# EAGLE design test (EAGLE 7.2.0)
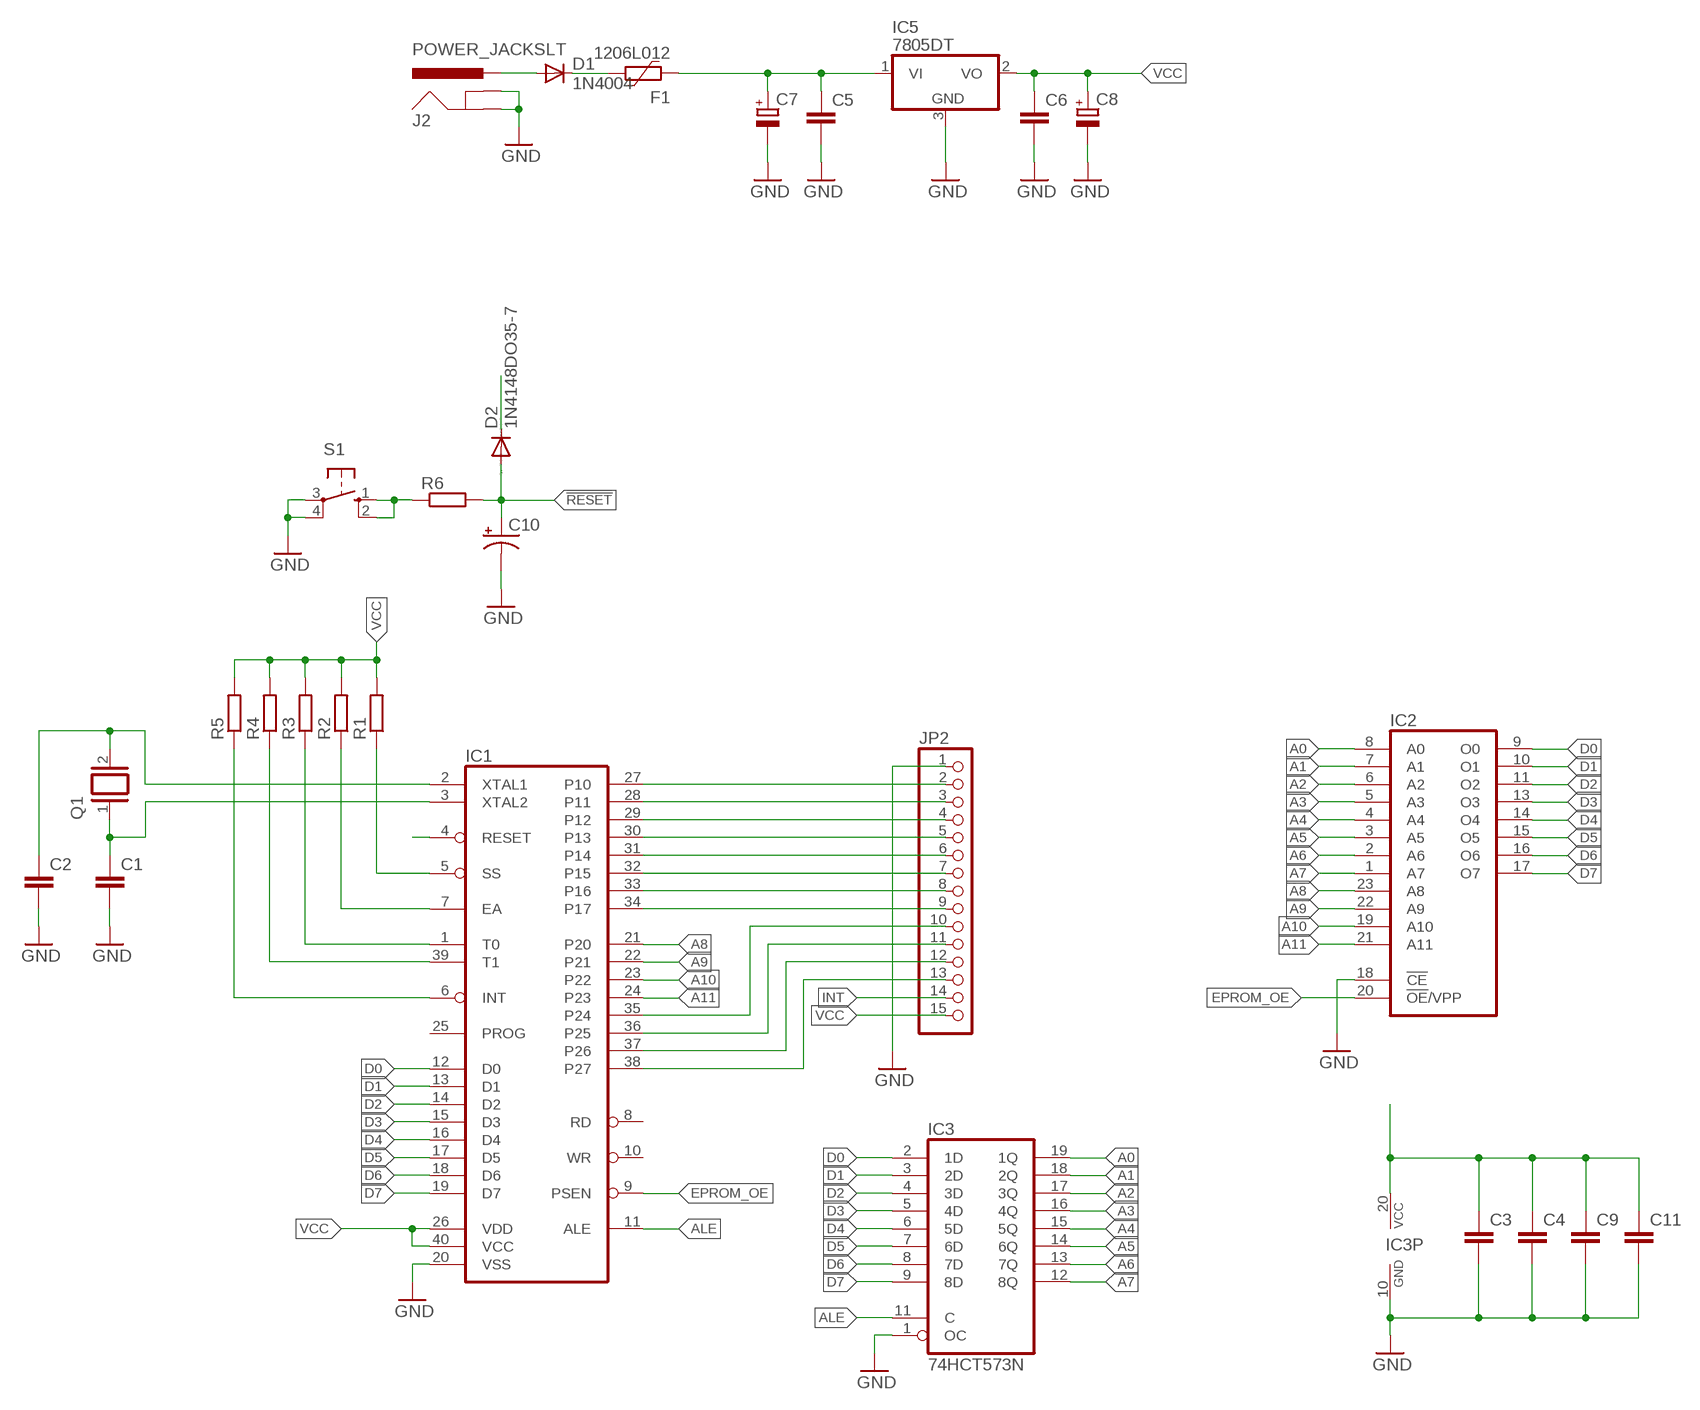
[diagram p0: schematic, sheet 1]

## Parts
C1  C-EUC0603  [C0603]
C2  C-EUC0603  [C0603]
C3  C-EUC0603  [C0603]
C4  C-EUC0603  [C0603]
C5  C-EUC0603  [C0603]
C6  C-EUC0603  [C0603]
C7  CPOL-EUSMCB  [SMC_B]
C8  CPOL-EUSMCB  [SMC_B]
C9  C-EUC0603  [C0603]
C10  CPOL-USE2,5-6E  [E2,5-6E]
C11  C-EUC0603  [C0603]
D1  1N4004  [DO41-10]
D2  1N4148DO35-7  [DO35-7]
F1  1206L012  [1206L]
IC1  8048  [DIL40]
IC2  2732  [DIL24]
IC3  74HCT573N  [DIL20]
IC5  7805DT  [TO252]
J2  POWER_JACKSLT  [POWER_JACK_SLOT]
JP2  PINHD-1X15  [1X15]
Q1  XTAL/S  [QS]
R1  R-EU_R1206  [R1206]
R2  R-EU_R1206  [R1206]
R3  R-EU_R1206  [R1206]
R4  R-EU_R0603  [R0603]
R5  R-EU_R1206  [R1206]
R6  R-EU_R0603  [R0603]
S1  10-XX  [B3F-10XX]

## Nets
9V: C5.1 C7.+ F1.2 IC5.1(VI)
!RESET: C10.+ D2.A IC1.4(RESET) R6.2
A0: IC2.8(A0) IC3.19(1Q)
A1: IC2.7(A1) IC3.18(2Q)
A2: IC2.6(A2) IC3.17(3Q)
A3: IC2.5(A3) IC3.16(4Q)
A4: IC2.4(A4) IC3.15(5Q)
A5: IC2.3(A5) IC3.14(6Q)
A6: IC2.2(A6) IC3.13(7Q)
A7: IC2.1(A7) IC3.12(8Q)
A8: IC1.21(P20) IC2.23(A8)
A9: IC1.22(P21) IC2.22(A9)
A10: IC1.23(P22) IC2.19(A10)
A11: IC1.24(P23) IC2.21(A11)
ALE: IC1.11(ALE) IC3.11(C)
D0: IC1.12(D0) IC2.9(O0) IC3.2(1D)
D1: IC1.13(D1) IC2.10(O1) IC3.3(2D)
D2: IC1.14(D2) IC2.11(O2) IC3.4(3D)
D3: IC1.15(D3) IC2.13(O3) IC3.5(4D)
D4: IC1.16(D4) IC2.14(O4) IC3.6(5D)
D5: IC1.17(D5) IC2.15(O5) IC3.7(6D)
D6: IC1.18(D6) IC2.16(O6) IC3.8(7D)
D7: IC1.19(D7) IC2.17(O7) IC3.9(8D)
EPROM_OE: IC1.9(PSEN) IC2.20(!OE!/VPP)
GND: C1.2 C2.2 C3.2 C4.2 C5.2 C6.2 C7.- C8.- C9.2 C10.- C11.2 IC1.20(VSS) IC2.18(!CE) IC3.1(OC) IC3.10(GND) IC5.3(GND) J2.GND@1(GNDBREAK) J2.GND@2(GND) JP2.1 S1.3(P) S1.4(P1)
INT: IC1.6(INT) JP2.14 R5.1
N$1: C1.1 IC1.3(XTAL2) Q1.1
N$2: C2.1 IC1.2(XTAL1) Q1.2
N$3: IC1.5(SS) R1.1
N$4: IC1.7(EA) R2.1
N$5: IC1.1(T0) R3.1
N$6: IC1.39(T1) R4.1
N$8: R6.1 S1.1(S) S1.2(S1)
N$9: IC1.27(P10) JP2.2
N$10: IC1.28(P11) JP2.3
N$11: IC1.29(P12) JP2.4
N$12: IC1.30(P13) JP2.5
N$13: IC1.31(P14) JP2.6
N$14: IC1.32(P15) JP2.7
N$15: IC1.33(P16) JP2.8
N$16: IC1.34(P17) JP2.9
N$17: IC1.35(P24) JP2.10
N$18: D1.A J2.PWR
N$19: IC1.36(P25) JP2.11
N$20: D1.C F1.1
N$21: IC1.37(P26) JP2.12
N$22: IC1.38(P27) JP2.13
VCC: C3.1 C4.1 C6.1 C8.+ C9.1 C11.1 D2.C IC1.26(VDD) IC1.40(VCC) IC3.20(VCC) IC5.2(VO) JP2.15 R1.2 R2.2 R3.2 R4.2 R5.2
Unconnected: IC1.8(RD) IC1.10(WR) IC1.25(PROG)

## Power pins joined to a net without a drawn wire
GND: IC2.12(GND)
VCC: IC2.24(VCC)

## Library data of the parts
C1-C6 C9 C11 = rcl:C-EU: CAPACITOR, European symbol
C7 C8 = rcl:CPOL-EU: POLARIZED CAPACITOR, European symbol
C10 = rcl:CPOL-US: POLARIZED CAPACITOR, American symbol
D1 = adafruit:1N4004: DIODE General purpose 1N400x type rectifier (With bigger pads) http://www.ladyada.net/library/pcb/eaglelibrary.html
D2 = diode:1N4148: DIODE high speed (Philips)
F1 = polyfuse-smd_10:?: Polyfuse Resettable PTC Source: http://www.littelfuse.com/products/resettable-ptcs.aspx; MF: Littelfuse; MPN: 1206L012; OC_FARNELL: 1596988; OC_NEWARK: 05M2298
IC1 = micro-intel:8048: MICROCOMPUTER/PERIPHERAL DEVICE; OC_FARNELL: unknown; OC_NEWARK: unknown
IC2 = memory:2732: MEMORY
IC3 = 74xx-eu:74*573: 8-bit D latch BUS DRIVER
IC5 = linear:78*: Positive VOLTAGE REGULATOR Source: http://cache.national.com/ds/LM/LM78L05.pdf http://www.fairchildsemi.com/ds/LM/LM7805.pdf
J2 = SparkFun-Connectors:POWER_JACK: Power Jack This is the standard 5.5mm barrel jack for power. The PTH is the most common, proven, reliable, footprint. The Slot footprint only works if the mill layer is transmitted to the PCB fab house so be warned. Mating wall wart : TOL-00298 (and others); PROD_ID: PRT-00119
JP2 = pinhead:PINHD-1X15: PIN HEADER
Q1 = special:XTAL/S: CRYSTAL
R1-R6 = rcl:R-EU_: RESISTOR, European symbol
S1 = switch-omron:10-XX: OMRON SWITCH; MPN: B3F-1000; OC_FARNELL: 176432; OC_NEWARK: 36M3542

## Board
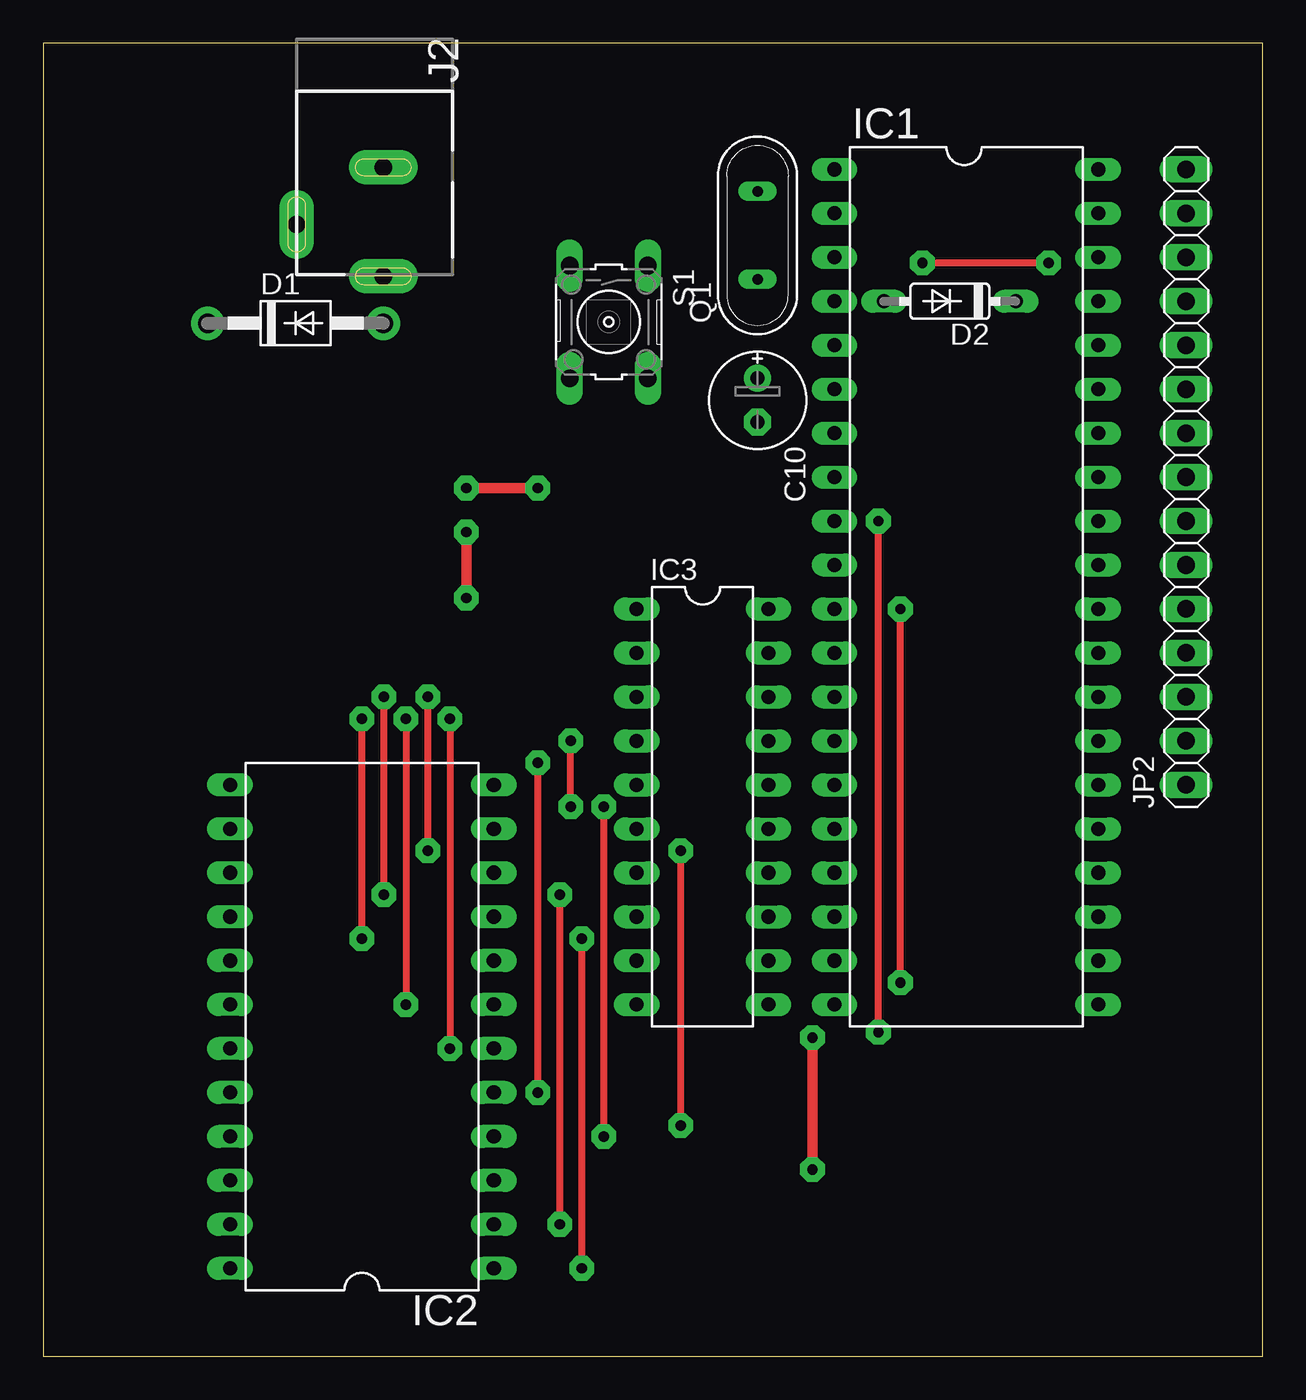
[diagram p1: board, top side]
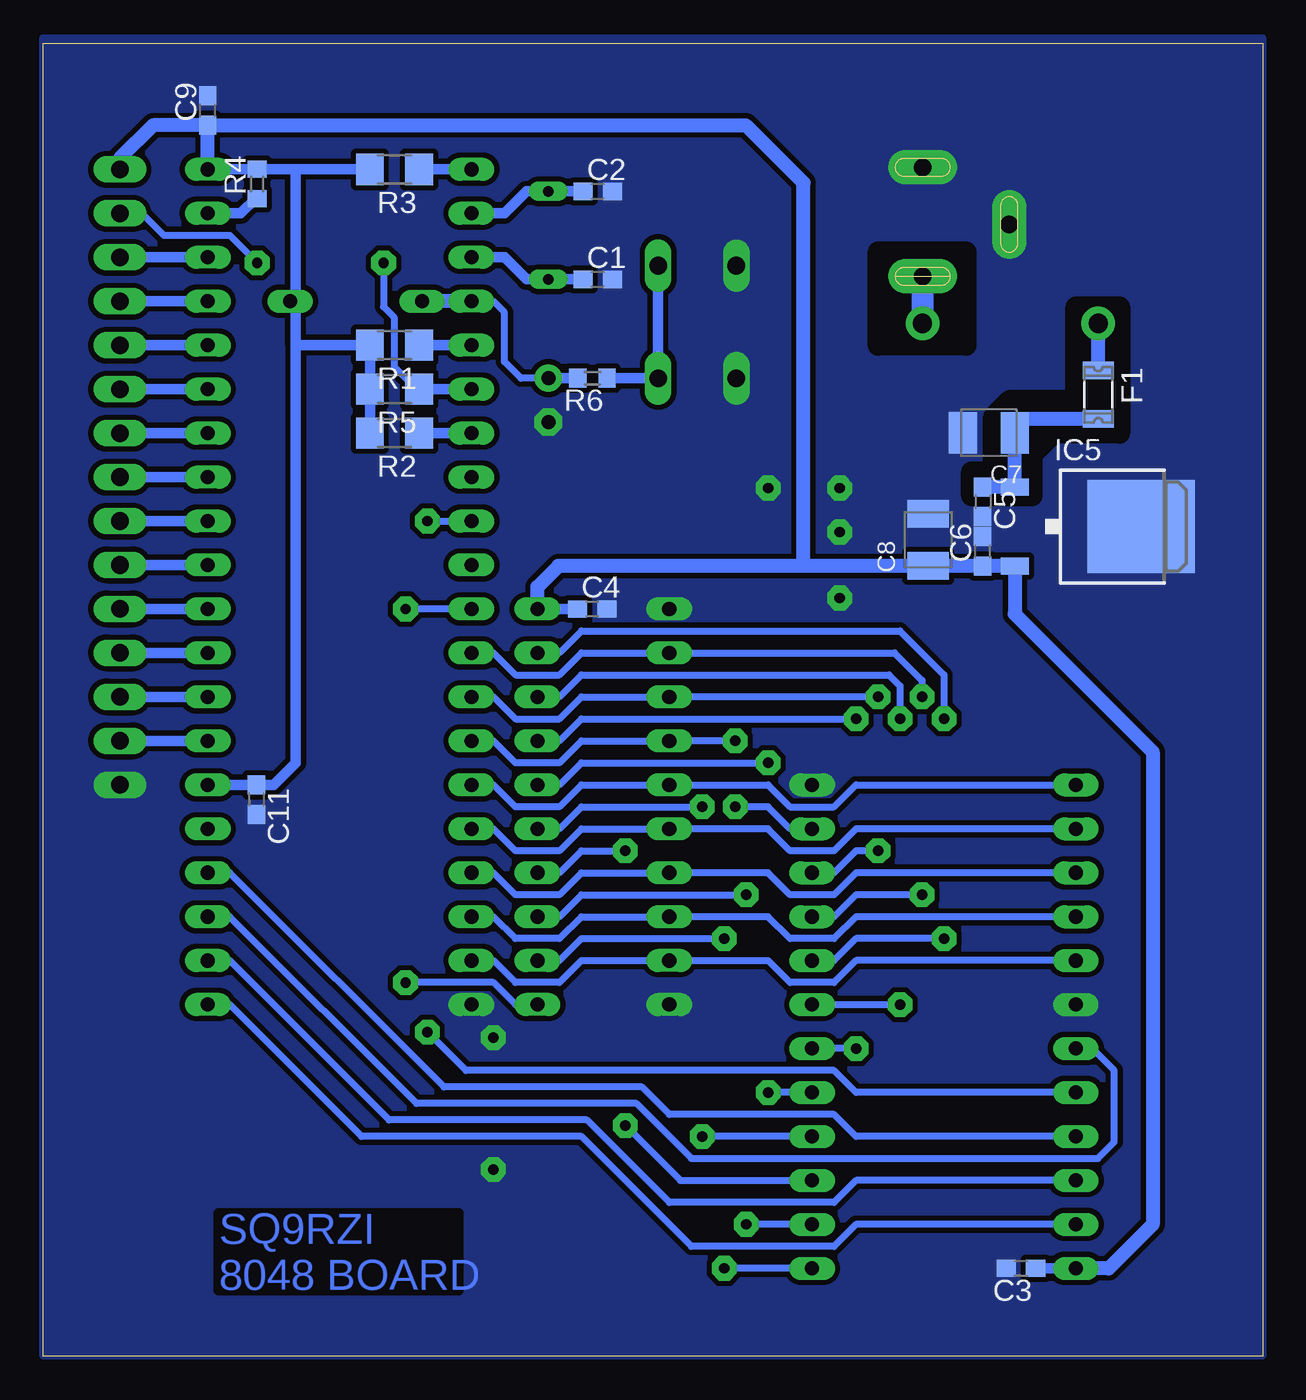
[diagram p2: board, bottom side, seen from below]

Size 70.47 x 75.87 mm. Coordinates in mm from the lower left corner, seen from the top.
Outline: 0,0 70.47,0 70.47,75.87 0,75.87 0,0
Copper layers (1*16): Top 0.035mm / dielectric 1.5mm / Bottom 0.035mm
Design rules "default *": minimum track width 10mil, minimum drill 24mil, track to track 8mil, track to pad 8mil, pad to pad 8mil, via to via 8mil, smd to smd 8mil, copper to edge 0mil, drill to drill 8mil, minimum pad ring 10mil, minimum via ring 8mil, stop-mask expansion 4mil, vias tented up to drill 0mil, thermal gap 10mil
bRestrict: area 17.1,58.4 to 22.2,63.8; area 8.3,49.7 to 16.8,60.6

### Footprints (pad centres in the part's own frame; a part is rotated, then mirrored left to right if it is on the bottom)
C0603 = smd 1.1 x 1: 1 -0.85,0; 2 0.85,0
SMC_B = smd 1.6 x 2.4: + -1.5,0; - 1.5,0
E2,5-6E = drill 0.813 pad 1.575: + -1.27,0 | drill 0.813 pad 1.575 octagon: - 1.27,0
DO41-10 = drill 1.118 pad 1.93: A 5.08,0; C -5.08,0
DO35-7 = drill 0.813 long: A 3.81,0; C -3.81,0
1206L = smd 1 x 1.8: 1 -1.4,0; 2 1.4,0
DIL40 = drill 0.813 long: 1 -24.13,-7.62; 2 -21.59,-7.62; 3 -19.05,-7.62; 4 -16.51,-7.62; 5 -13.97,-7.62; 6 -11.43,-7.62; 7 -8.89,-7.62; 8 -6.35,-7.62; 9 -3.81,-7.62; 10 -1.27,-7.62; 11 1.27,-7.62; 12 3.81,-7.62; 13 6.35,-7.62; 14 8.89,-7.62; 15 11.43,-7.62; 16 13.97,-7.62; 17 16.51,-7.62; 18 19.05,-7.62; 19 21.59,-7.62; 20 24.13,-7.62; 21 24.13,7.62; 22 21.59,7.62; 23 19.05,7.62; 24 16.51,7.62; 25 13.97,7.62; 26 11.43,7.62; 27 8.89,7.62; 28 6.35,7.62; 29 3.81,7.62; 30 1.27,7.62; 31 -1.27,7.62; 32 -3.81,7.62; 33 -6.35,7.62; 34 -8.89,7.62; 35 -11.43,7.62; 36 -13.97,7.62; 37 -16.51,7.62; 38 -19.05,7.62; 39 -21.59,7.62; 40 -24.13,7.62
DIL24 = drill 0.813 long: 1 -13.97,-7.62; 2 -11.43,-7.62; 3 -8.89,-7.62; 4 -6.35,-7.62; 5 -3.81,-7.62; 6 -1.27,-7.62; 7 1.27,-7.62; 8 3.81,-7.62; 9 6.35,-7.62; 10 8.89,-7.62; 11 11.43,-7.62; 12 13.97,-7.62; 13 13.97,7.62; 14 11.43,7.62; 15 8.89,7.62; 16 6.35,7.62; 17 3.81,7.62; 18 1.27,7.62; 19 -1.27,7.62; 20 -3.81,7.62; 21 -6.35,7.62; 22 -8.89,7.62; 23 -11.43,7.62; 24 -13.97,7.62
DIL20 = drill 0.813 long: 1 -11.43,-3.81; 2 -8.89,-3.81; 3 -6.35,-3.81; 4 -3.81,-3.81; 5 -1.27,-3.81; 6 1.27,-3.81; 7 3.81,-3.81; 8 6.35,-3.81; 9 8.89,-3.81; 10 11.43,-3.81; 11 11.43,3.81; 12 8.89,3.81; 13 6.35,3.81; 14 3.81,3.81; 15 1.27,3.81; 16 -1.27,3.81; 17 -3.81,3.81; 18 -6.35,3.81; 19 -8.89,3.81; 20 -11.43,3.81
TO252 = smd 1 x 1.6: 1 -2.28,-4.8; 2 2.28,-4.8 | smd 5.4 x 6.2: 3 0,2.5
POWER_JACK_SLOT = drill 1 pad 2 long: GND@1 2.58,7.5; GND@2 7.58,10.8; PWR 2.58,13.8
1X15 = drill 1.016 long: 1 -17.78,0; 2 -15.24,0; 3 -12.7,0; 4 -10.16,0; 5 -7.62,0; 6 -5.08,0; 7 -2.54,0; 8 0,0; 9 2.54,0; 10 5.08,0; 11 7.62,0; 12 10.16,0; 13 12.7,0; 14 15.24,0; 15 17.78,0
QS = drill 0.61 long: 1 -2.54,0; 2 2.54,0
R1206 = smd 1.6 x 1.803: 1 -1.422,0; 2 1.422,0
R0603 = smd 1 x 1.1: 1 -0.85,0; 2 0.85,0
B3F-10XX = drill 1.016 long: 1 -3.251,2.261; 2 3.251,2.261; 3 -3.251,-2.261; 4 3.251,-2.261

### Placement (x,y rotation side)
C1  38.42,62.23 0 bottom
C2  38.42,67.31 0 bottom
C3  13.97,5.08 180 bottom
C4  38.73,43.18 0 bottom
C5  16.18,49.38 270 bottom
C6  16.18,46.52 90 bottom
C7  15.82,53.37 180 bottom
C8  19.33,47.18 90 bottom
C9  60.96,71.98 90 bottom
C10  41.27,55.24 270 top
C11  58.15,32.17 270 bottom
D1  14.58,59.69 0 top
D2  52.39,60.96 180 top
F1  9.5,55.56 270 bottom
IC1  53.34,44.45 270 top
IC2  18.41,19.05 90 top
IC3  38.1,31.75 270 top
IC5  9.53,47.94 270 bottom
J2  22.23,76.2 180 top
JP2  66.04,50.8 90 top
Q1  41.27,64.77 90 top
R1  50.16,58.42 180 bottom
R2  50.16,53.34 180 bottom
R3  50.16,68.58 180 bottom
R4  58.1,67.74 90 bottom
R5  50.16,55.88 180 bottom
R6  38.73,56.52 180 bottom
S1  32.68,59.77 270 top

### Tracks (layer width: path | path; a pad name or v marks a point on that pad's centre or on a via)
9V
  Bottom 0.813: F1.2 14.32,54.16 C7.+ IC5.1 C5.1
!RESET
  Bottom 0.406: IC1.4 44.45,60.96 43.81,60.33 43.81,57.47 42.86,56.52 C10.+
  Bottom 0.61: R6.2 C10.+
  Bottom 0.813: IC1.4 D2.A
A0  (via drill 0.6 pad 1.42)
  Top 0.406: v18.41,24.13 v18.41,36.83
  Bottom 0.406: IC3.19 40.64,40.64 39.37,41.91 20.95,41.91 18.41,39.37 v18.41,36.83 | v18.41,24.13 23.5,24.13 24.77,22.86 IC2.8
A1  (via drill 0.6 pad 1.42)
  Top 0.406: v20.95,36.83 v20.95,20.32
  Bottom 0.406: IC3.18 40.64,38.1 39.37,39.37 21.59,39.37 20.95,38.73 v20.95,36.83 | IC2.7 v20.95,20.32
A2  (via drill 0.6 pad 1.42)
  Top 0.406: v23.5,36.83 v23.5,17.78
  Bottom 0.406: IC3.17 40.64,35.56 39.37,36.83 v23.5,36.83 | v23.5,17.78 IC2.6
A3  (via drill 0.6 pad 1.42)
  Top 0.406: v28.57,34.29 v28.57,15.24
  Bottom 0.406: IC3.16 40.64,33.02 39.37,34.29 v28.57,34.29 | IC2.5 v28.57,15.24
A4  (via drill 0.6 pad 1.42)
  Top 0.406: v32.38,31.75 v32.38,12.7
  Bottom 0.406: IC3.15 40.64,30.48 39.37,31.75 v32.38,31.75 | IC2.4 v32.38,12.7
A5  (via drill 0.6 pad 1.42)
  Top 0.406: v36.83,29.21 v36.83,13.34
  Bottom 0.406: IC3.14 40.64,27.94 39.37,29.21 v36.83,29.21 | IC2.3 33.66,10.16 v36.83,13.34
A6  (via drill 0.6 pad 1.42)
  Top 0.406: v29.84,26.67 v29.84,7.62
  Bottom 0.406: IC3.13 40.64,25.4 39.37,26.67 v29.84,26.67 | IC2.2 v29.84,7.62
A7  (via drill 0.6 pad 1.42)
  Top 0.406: v31.11,24.13 v31.11,5.08
  Bottom 0.406: IC3.12 40.64,22.86 39.37,24.13 v31.11,24.13 | IC2.1 v31.11,5.08
A8
  Bottom 0.406: IC2.23 23.5,7.62 24.77,6.35 33.02,6.35 39.37,12.7 52.07,12.7 59.69,20.32 IC1.21
A9
  Bottom 0.406: IC1.22 59.69,22.86 50.48,13.65 39.05,13.65 34.29,8.89 24.77,8.89 23.5,10.16 IC2.22
A10
  Bottom 0.406: IC1.23 59.69,25.4 48.9,14.61 36.2,14.61 33.02,11.43 9.53,11.43 8.57,12.38 8.57,16.51 9.84,17.78 IC2.19
A11
  Bottom 0.406: IC2.21 23.5,12.7 24.77,13.97 34.29,13.97 35.88,15.56 47.31,15.56 59.69,27.94 IC1.24
ALE  (via drill 0.6 pad 1.42)
  Top 0.406: v49.53,21.59 v49.53,43.18
  Bottom 0.406: IC3.11 43.18,20.32 44.45,21.59 v49.53,21.59 | IC1.11 v49.53,43.18
D0  (via drill 0.6 pad 1.42)
  Top 0.406: v19.68,26.67 v19.68,38.1
  Bottom 0.406: IC1.12 44.45,40.64 43.18,39.37 40.64,39.37 39.37,40.64 IC3.2 21.27,40.64 19.68,39.05 v19.68,38.1 | v19.68,26.67 23.5,26.67 24.77,25.4 IC2.9
D1  (via drill 0.6 pad 1.42)
  Top 0.406: v22.23,29.21 v22.23,38.1
  Bottom 0.406: IC1.13 44.45,38.1 43.18,36.83 40.64,36.83 39.37,38.1 IC3.3 v22.23,38.1 | v22.23,29.21 23.5,29.21 24.77,27.94 IC2.10
D2  (via drill 0.6 pad 1.42)
  Top 0.406: v30.48,31.75 v30.48,35.56
  Bottom 0.406: IC1.14 44.45,35.56 43.18,34.29 40.64,34.29 39.37,35.56 IC3.4 v30.48,35.56 | v30.48,31.75 28.57,31.75 27.3,30.48 IC2.11
D3
  Bottom 0.406: IC1.15 44.45,33.02 43.18,31.75 40.64,31.75 39.37,33.02 IC3.5 28.57,33.02 27.3,31.75 24.77,31.75 23.5,33.02 IC2.13
D4
  Bottom 0.406: IC1.16 44.45,30.48 43.18,29.21 40.64,29.21 39.37,30.48 IC3.6 28.57,30.48 27.3,29.21 24.77,29.21 23.5,30.48 IC2.14
D5
  Bottom 0.406: IC1.17 44.45,27.94 43.18,26.67 40.64,26.67 39.37,27.94 IC3.7 28.57,27.94 27.3,26.67 24.77,26.67 23.5,27.94 IC2.15
D6
  Bottom 0.406: IC1.18 44.45,25.4 43.18,24.13 40.64,24.13 39.37,25.4 IC3.8 28.57,25.4 27.3,24.13 24.77,24.13 23.5,25.4 IC2.16
D7
  Bottom 0.406: IC1.19 44.45,22.86 43.18,21.59 40.64,21.59 39.37,22.86 IC3.9 28.57,22.86 27.3,21.59 24.77,21.59 23.5,22.86 IC2.17
EPROM_OE  (via drill 0.6 pad 1.42)
  Top 0.406: v48.26,18.73 v48.26,48.26
  Bottom 0.406: v48.26,48.26 IC1.9 | IC2.20 23.5,15.24 24.77,16.51 46.04,16.51 v48.26,18.73
GND  (via drill 0.6 pad 1.42)
  Top 0.61: v44.45,18.41 v44.45,10.79 | v24.45,47.62 v24.45,43.81 | v24.45,50.16 v28.57,50.16
  pour Bottom (isolate 0.305, no thermals): 0,76.2 0,0 70.48,0 70.48,76.2
INT  (via drill 0.6 pad 1.42)
  Top 0.406: v50.8,63.18 v58.1,63.18
  Bottom 0.406: JP2.14 64.77,66.04 63.5,64.77 59.69,64.77 v58.1,63.18 | R5.1 48.9,55.88 50.16,57.15 50.16,60.01 50.8,60.64 v50.8,63.18
  Bottom 0.61: IC1.6 R5.1
N$1
  Bottom 0.61: IC1.3 43.81,63.5 42.55,62.23 Q1.1 C1.1
N$2
  Bottom 0.61: IC1.2 43.81,66.04 42.55,67.31 Q1.2 C2.1
N$3
  Bottom 0.61: IC1.5 R1.1
N$4
  Bottom 0.61: IC1.7 R2.1
N$5
  Bottom 0.61: IC1.1 R3.1
N$6
  Bottom 0.61: IC1.39 59.05,66.04 58.2,66.89 R4.1
N$8
  Bottom 0.61: R6.1 S1.2 S1.1
N$9
  Bottom 0.61: IC1.27 JP2.2
N$10
  Bottom 0.61: IC1.28 JP2.3
N$11
  Bottom 0.61: IC1.29 JP2.4
N$12
  Bottom 0.61: IC1.30 JP2.5
N$13
  Bottom 0.61: IC1.31 JP2.6
N$14
  Bottom 0.61: IC1.32 JP2.7
N$15
  Bottom 0.61: IC1.33 JP2.8
N$16
  Bottom 0.61: IC1.34 JP2.9
N$17
  Bottom 0.61: IC1.35 JP2.10
N$18
  Bottom 1.27: D1.A 19.64,59.69 J2.PWR
N$19
  Bottom 0.61: IC1.36 JP2.11
N$20
  Bottom 0.813: F1.1 D1.C
N$21
  Bottom 0.61: IC1.37 JP2.12
N$22
  Bottom 0.61: IC1.38 JP2.13
VCC
  Bottom 0.406: C11.1 58.42,33.02 | D2.C 55.88,60.96
  Bottom 0.61: R2.2 R5.2 R1.2 55.88,58.42 | R3.2 55.88,68.58 | 55.88,68.58 58.42,68.58 | 58.42,68.58 IC1.40 | R4.2 58.41,68.59 58.42,68.58 | C3.1 IC2.24 | C4.1 IC3.20 | 55.88,58.42 55.88,34.29 57.15,33.02 58.42,33.02 IC1.26 | 55.88,58.42 55.88,60.96 55.88,68.58
  Bottom 0.813: 15.88,45.66 IC5.2 14.32,42.9 6.35,34.92 6.35,7.62 8.89,5.08 IC2.24 | 15.88,45.66 19.05,45.66 | 19.05,45.66 26.53,45.66 | 26.53,45.66 40.7,45.66 41.91,44.45 IC3.20 | 26.53,45.66 26.53,67.81 29.86,71.13 C9.1 | C6.1 15.88,45.66 | C8.+ 19.05,45.68 19.05,45.66 | IC1.40 C9.1 | C9.1 64.12,71.13 66.04,69.22 JP2.15

### Text on the board
Bottom: SQ9RZI / 8048 BOARD